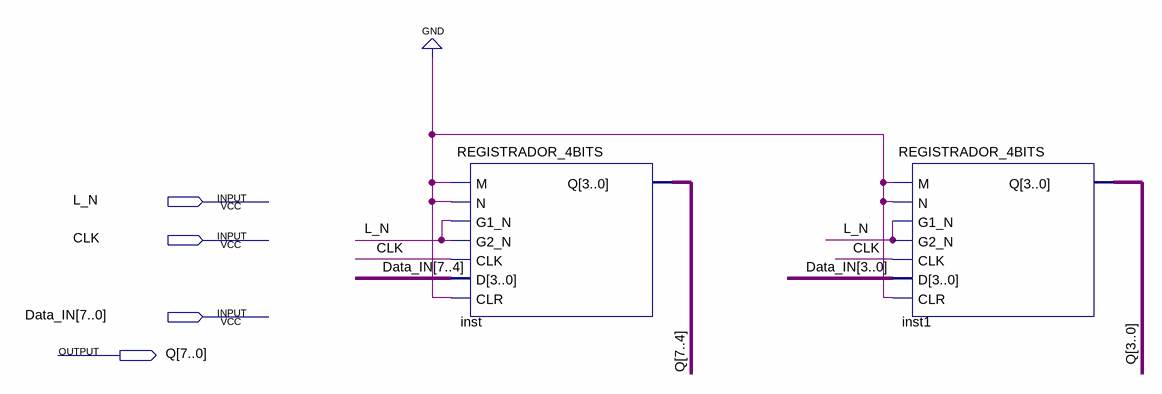
[diagram p0: schematic sheet]
// Quartus schematic REGISTRADOR_8BITS.bdf as structural Verilog: 2 symbols, 4 pins
module REGISTRADOR_8BITS (
  input  L_N,
  input  CLK,
  input  [7:0] Data_IN,
  output [7:0] Q
);

  REGISTRADOR_4BITS inst (
    .M(1'b0), .N(1'b0), .G1_N(L_N), .G2_N(L_N), .CLK(CLK), .D(Data_IN[7:4]), .CLR(1'b0), .Q(Q[7:4]));
  REGISTRADOR_4BITS inst1 (
    .M(1'b0), .N(1'b0), .G1_N(L_N), .G2_N(L_N), .CLK(CLK), .D(Data_IN[3:0]), .CLR(1'b0), .Q(Q[3:0]));
endmodule
